# Altium schematic sheet 2,ФБ1,Чертеж,Схема_принципиальная.SchDoc
size A4; SheetNumber: 2; SheetTotal: 2
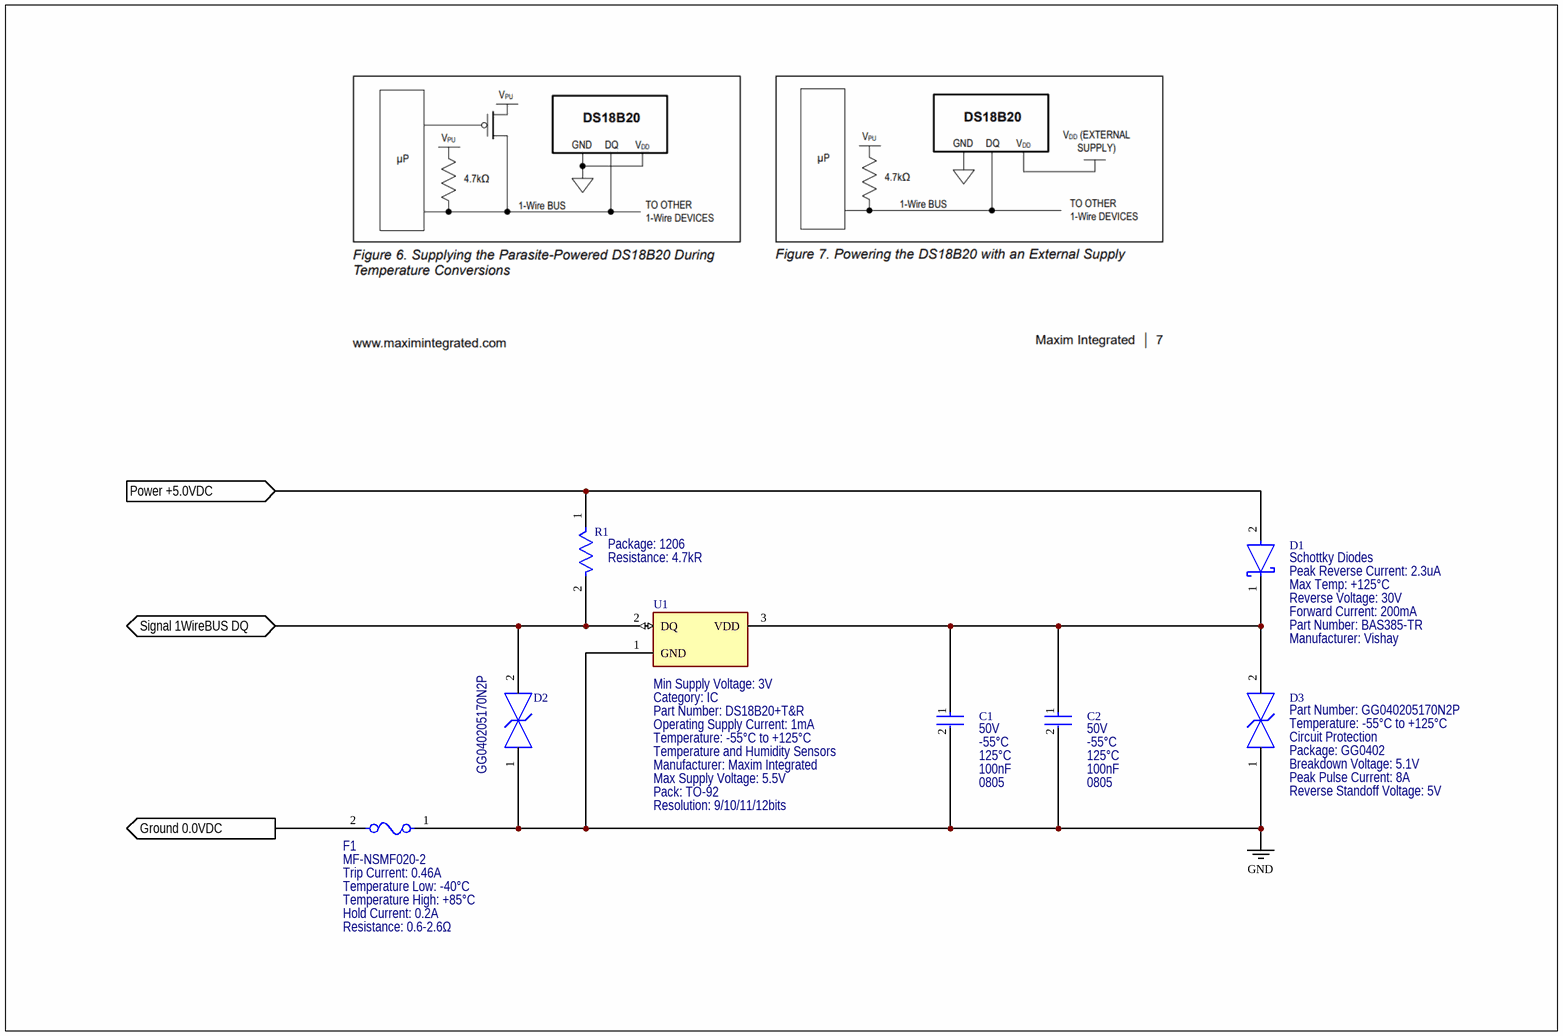
[diagram p0: 2,ФБ1,Чертеж,Схема_принципиальная.SchDoc]

## Parts
C1  Voltage Rating: 50V  Min Operating Temperature: -55°C  Max Operating Temperature: 125°C  Capacitance: 100nF  Case Code (Imperial): 0805  [FP-GCD21B-0_15-IPC_C]  (hidden comment: GCD21BR71H104KA01L)
C2  Voltage Rating: 50V  Min Operating Temperature: -55°C  Max Operating Temperature: 125°C  Capacitance: 100nF  Case Code (Imperial): 0805  [FP-GCD21B-0_15-IPC_C]  (hidden comment: GCD21BR71H104KA01L)
D1  Device Class L3: Schottky Diodes  Peak Reverse Current: 2.3uA  Max Temp: +125°C  Reverse Voltage: 30V  Forward Current: 200mA  Manufacturer: Vishay  [FP-6_560-5007_01-4-MFG]  (hidden comment: BAS385-TR)
D2  GG040205170N2P  [FP-GG0402-MFG]
D3  Temperature: -55°C to +125°C  Device Class L1: Circuit Protection  Package: GG0402  Breakdown Voltage: 5.1V  Peak Pulse Current: 8A  Reverse Standoff Voltage: 5V  [FP-GG0402-MFG]  (hidden comment: GG040205170N2P)
F1  MF-NSMF020-2  Trip Current: 0.46A  Temperature Low: -40°C  Temperature High: +85°C  Hold Current: 0.2A  Resistance: 0.6-2.6Ω  [FP-MF-NSMF020-2-MFG]
R1  Package: 1206  Resistance: 4.7kR  [FP-RC3216-IPC_A]  (hidden comment: RC3216F472CS)
U1  Pack: TO-92  Min Supply Voltage: 3V  Category: IC  Operating Supply Current: 1mA  Temperature: -55°C to +125°C  Device Class L2: Temperature and Humidity Sensors  Manufacturer: Maxim Integrated  Max Supply Voltage: 5.5V  Resolution: 9/10/11/12bits  [FP-Q3-4-MFG]  (hidden comment: DS18B20+T&R)

## Ports
Ground 0.0VDC (out), Power +5.0VDC (in), Signal 1WireBUS DQ (bidir)

## Nets
GND: C1.2 C2.2 D2.1 D3.1 F1.1 U1.1(GND)
Ground 0.0VDC: F1.2 ; port Ground 0.0VDC
Power +5.0VDC: D1.2(A) R1.1 ; port Power +5.0VDC
Signal 1WireBUS DQ: D2.2 R1.2 U1.2(DQ) ; port Signal 1WireBUS DQ
NetC1_1: C1.1 C2.1 D1.1(C) D3.2 U1.3(VDD)

## Library data of the parts
C1 C2 = CMP-06035-045527-1: Chip Multilayer Ceramic Capacitors for Automotive, 0805, 0.10uF, X7R, 15%, 10%, 50V, Grade 1; Case Code (Metric): 2012; Height: 1.25mm; Weight: 0.000335oz; Mount: Surface Mount; Width: 0.049inch; Packaging: Tape and Reel; Depth: 1.25mm; Length: 2mm; Ratings: AEC-Q200; Termination: SMD/SMT; Thickness: 0.049inch; Case/Package: 0805; Voltage Rating (DC): 50V; Dielectric: X7R; Tolerance: 10%; Package Quantity: 3000
D1 = CMP-02539-000034-1: DIODE SCHOTTKY 30V 200MA MICMELF; Value: 10pF; Automotive Grade: Grade 1; Max Surge Forward Current: 5A; ComponentLink2Description: Datasheet; ComponentLink2URL: http://www.vishay.com/docs/85504/bas385.pdf; Device Class L2: Diodes; Device Class L1: Discrete Semiconductors; Mouser Description: Schottky Diodes & Rectifiers 30 Volt 200mA 300mA IFSM; Digikey Description: DIODE SCHOTTKY 30V 200MA MICMELF; Temperature: to +125°C; RoHS: TRUE; Temperature Range High: +125°C; Automotive: Yes; Lead Free: Yes; Package: 6.560-5007.01-4; Capacitance: 10pF; Category: Diode; Octopart: https://octopart.com/bas385-tr-vishay-55507548; Part Number: BAS385-TR; Height: 1.2mm
D2 = CMP-04587-000002-1: TVS DIODE 5V 10V 0402; Manufacturer: AVX; Capacitance: 17pF; Peak Pulse Power: 80W; Value: 17pF; Number Of Channels: 1; Direction: Bidirectional; Breakdown Voltage: 5.1V; Peak Pulse Current: 8A; Part Number: GG040205170N2P; Temperature: -55°C to +125°C; Octopart: https://octopart.com/gg040205170n2p-avx-81066082; RoHS: TRUE; Clamping Voltage: 10V; Device Class L1: Circuit Protection; ComponentLink2Description: Datasheet; Category: Diode; Package: GG0402; Temperature Range High: +125°C; Digikey Description: TVS DIODE 5V 10V 0402; Ipc Land Pattern Name: DIOC10060X50; Device Class L3: unset; Automotive: No; Mouser Description: ESD Suppressor TVS Bi-Dir 5V 2-Pin Case 0402(1006Metric) T/R; ComponentLink2URL: http://datasheets.avx.com/AVX-GiGuard.pdf; Height: 0.55mm; Lead Free: Yes; Reverse Standoff Voltage: 5V; Device Class L2: TVS Diodes; Temperature Range Low: -55°C
D3 = CMP-04587-000002-1: TVS DIODE 5V 10V 0402; Manufacturer: AVX; Capacitance: 17pF; Peak Pulse Power: 80W; Value: 17pF; Number Of Channels: 1; Direction: Bidirectional; Part Number: GG040205170N2P; Octopart: https://octopart.com/gg040205170n2p-avx-81066082; RoHS: TRUE; Clamping Voltage: 10V; ComponentLink2Description: Datasheet; Category: Diode; Temperature Range High: +125°C; Digikey Description: TVS DIODE 5V 10V 0402; Ipc Land Pattern Name: DIOC10060X50; Device Class L3: unset; Automotive: No; Mouser Description: ESD Suppressor TVS Bi-Dir 5V 2-Pin Case 0402(1006Metric) T/R; ComponentLink2URL: http://datasheets.avx.com/AVX-GiGuard.pdf; Height: 0.55mm; Lead Free: Yes; Device Class L2: TVS Diodes; Temperature Range Low: -55°C
F1 = CMP-07400-000029-1: PTC RESET FUSE 24V 200MA 1206; Manufacturer: Bourns; Trip Time: 0.6s; Current Rating: 10A; Automotive Grade: Grade 3; Value: 0.6-2.6Ω; Voltage Rating: 24V; Device Class L1: Circuit Protection; Temperature Range Low: -40°C; Temperature: -40°C to +85°C; Category: Fuse; Temperature Range High: +85°C; Mouser Description: Resettable Fuses - PPTC 0.20A 24V 0.60ohm MAX (R); Device Class L3: unset; RoHS: TRUE; Package: MF-NSMF020-2; ComponentLink2Description: Datasheet; Digikey Description: PTC RESET FUSE 24V 200MA 1206; Device Class L2: PTC Resettable Fuses; Manufacturer Part Number: MF-NSMF020-2; Octopart: https://octopart.com/mf-nsmf020-2-bourns-94649; Automotive: Yes; Height: 0.85mm; Lead Free: Yes; ComponentLink2URL: https://www.bourns.com/docs/Product-Datasheets/mfnsmf.pdf
R1 = CMP-13261-005727-1: Res Thick Film 1206 4.7kΩ 1% 0.25W ±100ppm/°C Molded SMD T/R; Max Power Dissipation: 250mW; Voltage Rating (DC): 200V; Case Code (Metric): 3216; Number of Terminations: 2; Length: 0.126inch; Contact Plating: Tin; Features: Moisture Resistant; Radiation Hardening: No; Tolerance: 1%; Min Operating Temperature: -55°C; Depth: 1.6mm; Lead Free: Lead Free; Composition: Thick Film; Height: 0.026inch; Width: 0.063inch; Temperature Coefficient: 100ppm/°C; Max Operating Temperature: 155°C; Packaging: Tape and Reel; Case Code (Imperial): 1206; Military Standard: Not
U1 = CMP-0253-00001-2: SENSOR DIGITAL -55C-125C TO92-3; Sensor Output: Other; Standoff Height: 0.51mm; Package: Q3-4; Octopart: https://octopart.com/ds18b20%2Bt%26r-maxim+integrated-10547047; Automotive: No; Temperature Range Low: -55°C; ComponentLink2Description: Datasheet; Digikey Description: SENSOR DIGITAL -55C-125C TO92-3; Height: 9.4mm; Part Number: DS18B20+T&R; ComponentLink2URL: https://datasheets.maximintegrated.com/en/ds/DS18B20.pdf; Lead Free: Yes; Device Class L3: unset; Device Class L1: Sensors; Temperature Range High: +125°C; Mouser Description: Board Mount Temperature Sensors; Interface: Other; RoHS: TRUE